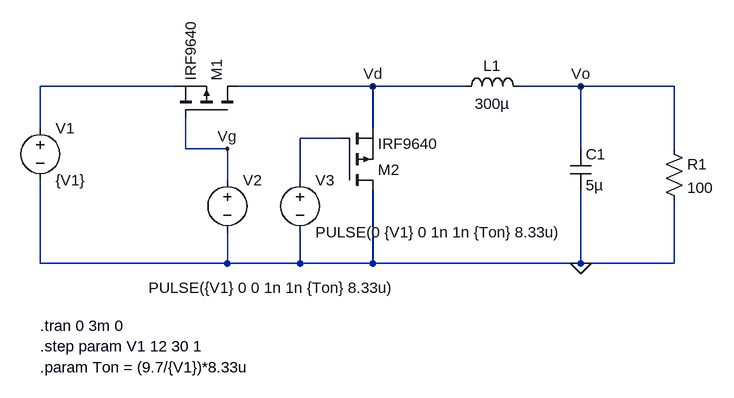
[diagram p0: schematic buck_pmos.asc]
buck_pmos.asc, the LTspice schematic file:
Version 4
SHEET 1 1096 680
WIRE 240 48 32 48
WIRE 544 48 336 48
WIRE 688 48 544 48
WIRE 864 48 768 48
WIRE 1008 48 864 48
WIRE 32 112 32 48
WIRE 544 112 544 48
WIRE 496 128 432 128
WIRE 256 144 256 96
WIRE 320 144 256 144
WIRE 864 144 864 48
WIRE 1008 144 1008 48
WIRE 320 192 320 144
WIRE 432 192 432 128
WIRE 32 320 32 192
WIRE 320 320 320 272
WIRE 320 320 32 320
WIRE 432 320 432 272
WIRE 432 320 320 320
WIRE 544 320 544 208
WIRE 544 320 432 320
WIRE 864 320 864 208
WIRE 864 320 544 320
WIRE 1008 320 1008 224
WIRE 1008 320 864 320
FLAG 864 320 0
FLAG 864 48 Vo
FLAG 320 144 Vg
FLAG 544 48 Vd
SYMBOL voltage 32 96 R0
WINDOW 123 0 0 Left 0
WINDOW 39 0 0 Left 0
SYMATTR InstName V1
SYMATTR Value {V1}
SYMBOL voltage 320 176 R0
WINDOW 3 -121 182 Left 2
WINDOW 123 0 0 Left 0
WINDOW 39 0 0 Left 0
SYMATTR Value PULSE({V1} 0 0 1n 1n {Ton} 8.33u)
SYMATTR InstName V2
SYMBOL ind 672 64 R270
WINDOW 0 32 56 VTop 2
WINDOW 3 5 56 VBottom 2
SYMATTR InstName L1
SYMATTR Value 300µ
SYMBOL cap 848 144 R0
SYMATTR InstName C1
SYMATTR Value 5µ
SYMBOL pmos 336 96 M270
SYMATTR InstName M1
SYMATTR Value IRF9640
SYMBOL res 992 128 R0
SYMATTR InstName R1
SYMATTR Value 100
SYMBOL voltage 432 176 R0
WINDOW 123 0 0 Left 0
WINDOW 39 0 0 Left 0
SYMATTR InstName V3
SYMATTR Value PULSE(0 {V1} 0 1n 1n {Ton} 8.33u)
SYMBOL pmos 496 208 M180
SYMATTR InstName M2
SYMATTR Value IRF9640
TEXT 32 416 Left 2 !.tran 0 3m 0
TEXT 32 448 Left 2 !.step param V1 12 30 1
TEXT 32 480 Left 2 !.param Ton = (9.7/{V1})*8.33u

The netlist it stands for:
* buck_pmos.asc
V1 N001 0 {V1}
V2 Vg 0 PULSE({V1} 0 0 1n 1n {Ton} 8.33u)
L1 Vd Vo 300µ
C1 Vo 0 5µ
M1 Vd Vg N001 N001 IRF9640
R1 Vo 0 100
V3 N002 0 PULSE(0 {V1} 0 1n 1n {Ton} 8.33u)
M2 0 N002 Vd Vd IRF9640
.model NMOS NMOS
.model PMOS PMOS
.lib standard.mos
.tran 0 3m 0
.step param V1 12 30 1
.param Ton = (9.7/{V1})*8.33u
.backanno
.end